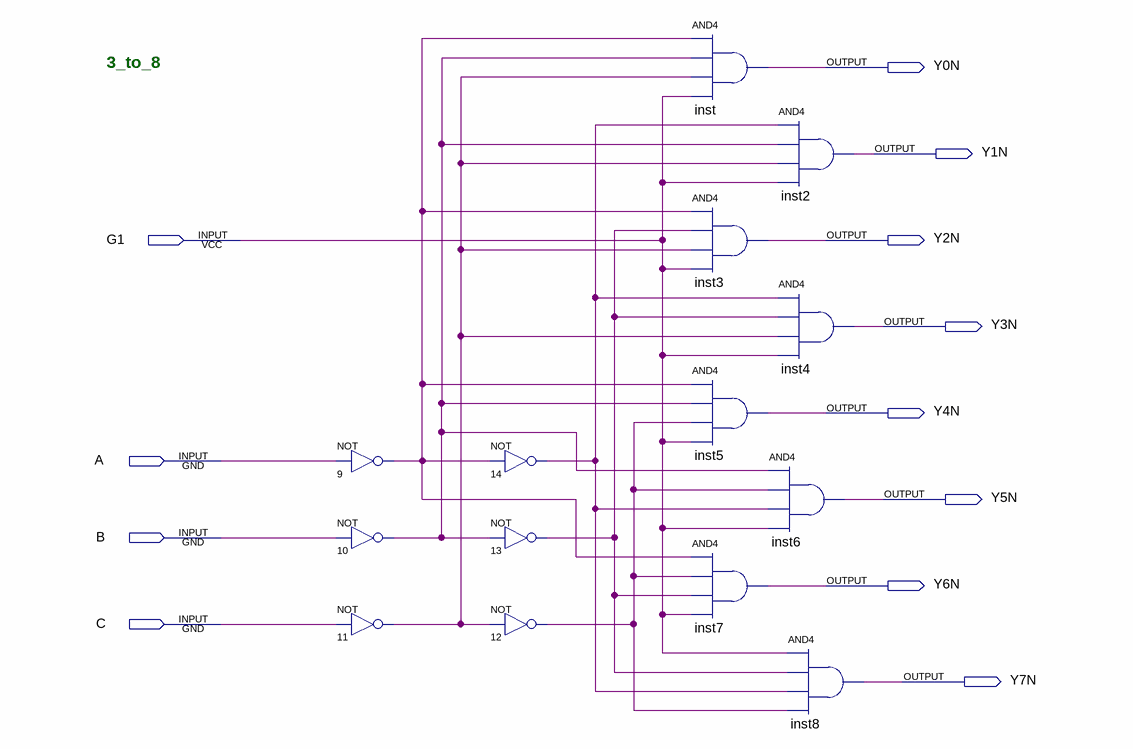
[diagram p0: schematic sheet]
// Quartus schematic 3_to_8.bdf as structural Verilog: 14 symbols, 12 pins
module \3_to_8  (
  input  G1,
  input  A,
  input  B,
  input  C,
  output Y0N,
  output Y1N,
  output Y2N,
  output Y3N,
  output Y4N,
  output Y5N,
  output Y6N,
  output Y7N
);

  wire n9_out, n10_out, n11_out, n12_out, n13_out, n14_out;

  not u_9 (n9_out, A);
  not u_10 (n10_out, B);
  not u_11 (n11_out, C);
  not u_14 (n14_out, n9_out);
  not u_13 (n13_out, n10_out);
  not u_12 (n12_out, n11_out);
  and inst (Y0N, n9_out, n10_out, n11_out, G1);
  and inst3 (Y2N, n9_out, n13_out, n11_out, G1);
  and inst5 (Y4N, n9_out, n10_out, n12_out, G1);
  and inst7 (Y6N, n9_out, n12_out, n13_out, G1);
  and inst6 (Y5N, n10_out, n12_out, n14_out, G1);
  and inst2 (Y1N, n14_out, n10_out, n11_out, G1);
  and inst4 (Y3N, n14_out, n13_out, n11_out, G1);
  and inst8 (Y7N, G1, n13_out, n14_out, n12_out);

  // Notes on the sheet:
  //   3_to_8
endmodule
